# EAGLE design mp4560_ps (EAGLE 8.1.1)
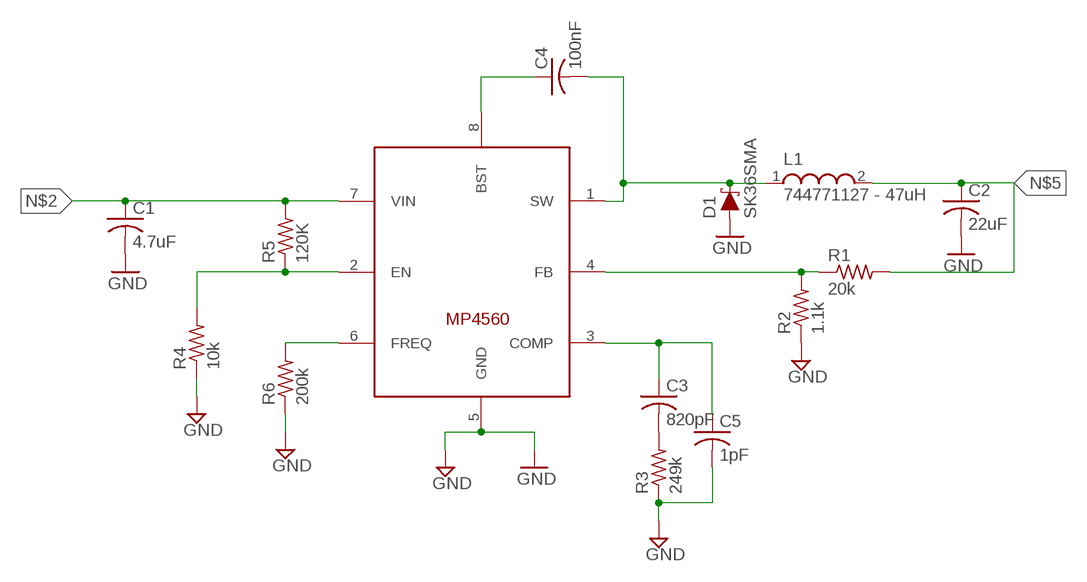
[diagram p0: schematic, sheet 1]

## Parts
C1  4.7uF  C-USC1210  [C1210]
C2  22uF  C-USC1210  [C1210]
C3  820pF  C-USC0805  [C0805]
C4  100nF  C-USC0805  [C0805]
C5  1pF  C-USC0805  [C0805]
D1  SK36SMA  DIODE-SCHOTTKY-B340A  [SMA-DIODE]
L1  744771127 - 47uH  WE-PD_1260/1245/1280/1210  [WE-PD_1260/1245/1280/1210]
R1  20k  R-US_R0805  [R0805]
R2  1.1k  R-US_R0805  [R0805]
R3  249k  R-US_R0805  [R0805]
R4  10k  R-US_R0805  [R0805]
R5  120K  R-US_R0805  [R0805]
R6  200k  R-US_R0805  [R0805]
U$1  MP4560  [SOIC8]

## Nets
GND: C1.2 C2.2 C5.2 D1.A R2.1 R3.1 R4.1 R6.1 U$1.5(GND)
N$1: R4.2 R5.1 U$1.2(EN)
N$2: C1.1 R5.2 U$1.7(VIN)
N$3: R6.2 U$1.6(FREQ)
N$4: R1.1 R2.2 U$1.4(FB)
N$5: C2.1 L1.2 R1.2
N$6: C4.1 U$1.8(BST)
N$8: C4.2 D1.C L1.1 U$1.1(SW)
N$9: C3.2 R3.2
N$10: C3.1 C5.1 U$1.3(COMP)

## Library data of the parts
C1-C5 = adafruit:C-US: CAPACITOR, American symbol
D1 = SparkFun-DiscreteSemi:DIODE-SCHOTTKY: Schottky diode A Schottky diode is a semiconductor diode which has a low forward voltage drop and a very fast switching action.; PROD_ID: DIO-09886; VALUE: 3A/40V/500mV
L1 = EAGLE-POWER_MAGNETICS-rev17a:WE-PD: SMD Shielded Power Inductor Characteristics Magnetically shielded version which results in a low leakage field High Saturation currents up to 25 A Very low self-losses at high switching frequency‘s Wide inductances spectrum available at all sizes Operating temperature: –40 °C to +125 °C Applications Perfectly suitable for switching regulators with extremely high efficiency Integrated DC/DC- converter Switching regulators with low operating voltages (Graphic cards, embedded PC-Cards, Mainboards) Plastic base: Because of the one piece construction these are more suitable for high vibration or shock applications <http://katalog.we-online.de/media/images/v2/Family_WE-PD.jpg> Details see: http://katalog.we-online.de/en/pbs/WE-PD? Updated by Dan Xu 2014-07-08 2014 (C) Wurth Elektronik
R1-R6 = adafruit:R-US_: RESISTOR, American symbol
U$1 = so8-0005:MP4560

## Net classes
0 default: clearance 0.254 mm

## Board
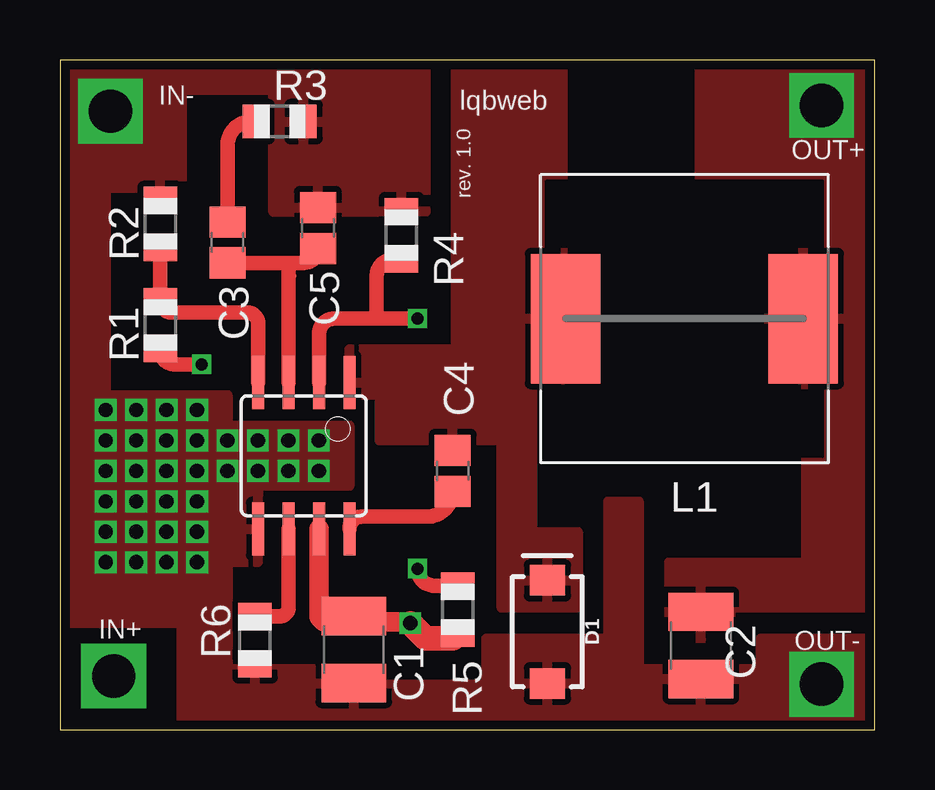
[diagram p1: board, top side]
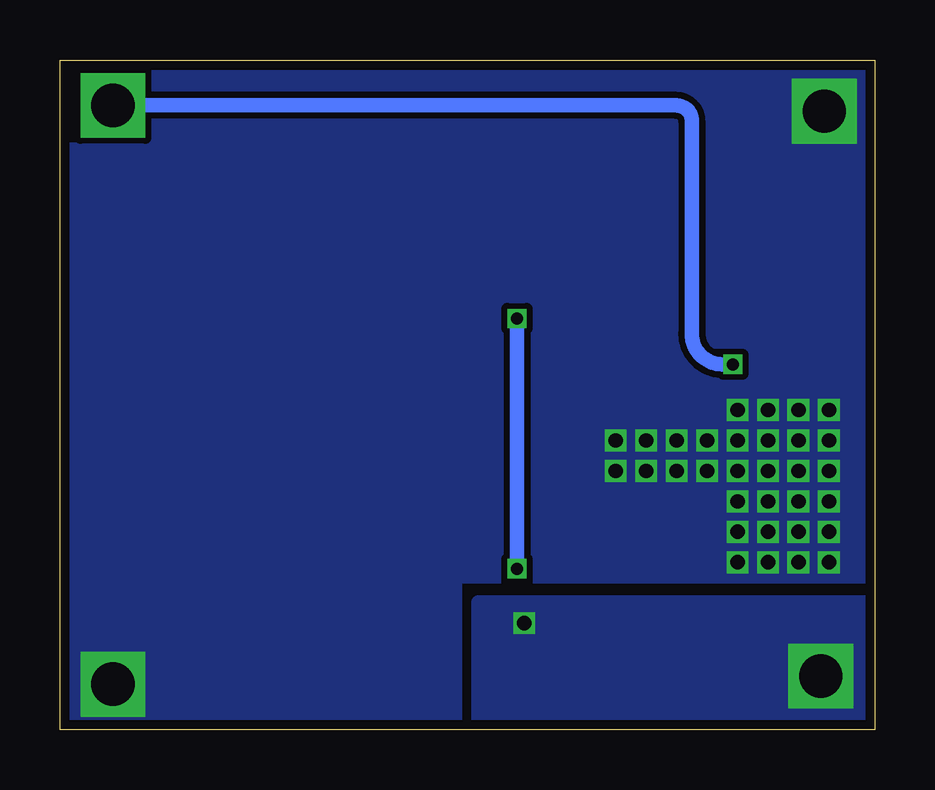
[diagram p2: board, bottom side, seen from below]

Size 33.96 x 27.93 mm. Coordinates in mm from the lower left corner, seen from the top.
Outline: 0,0 33.96,0 33.96,27.93 0,27.93 0,0
Copper layers (1*16): Top 0.035mm / dielectric 1.5mm / Bottom 0.035mm
Design rules "NOA Eagle Rule 2016-06-12": minimum track width 6mil, minimum drill 0.3mm, track to track 6mil, track to pad 6mil, pad to pad 6mil, via to via 6mil, smd to smd 0mil, copper to edge 0.4mm, drill to drill 10mil, minimum pad ring 10mil, minimum via ring 6mil, stop-mask expansion 2mil, vias tented up to drill 25mil, thermal gap 10mil

### Footprints (pad centres in the part's own frame; a part is rotated, then mirrored left to right if it is on the bottom)
C1210 = smd 1.6 x 2.7: 1 -1.4,0; 2 1.4,0
C0805 = smd 1.3 x 1.5: 1 -0.85,0; 2 0.85,0
SMA-DIODE = smd 1.27 x 1.47: A -2.15,0; C 2.15,0
WE-PD_1260/1245/1280/1210 = smd 2.9 x 5.4: 1 -4.95,0; 2 4.95,0
R0805 = smd 1.1 x 1.4: 1 -1,0; 2 1,0
SOIC8 = smd 0.5 x 2.2: 1 -1.905,-3.048; 2 -0.645,-3.048; 3 0.625,-3.048; 4 1.895,-3.048; 5 1.905,3.048; 6 0.635,3.048; 7 -0.635,3.048; 8 -1.905,3.048

### Placement (x,y rotation side)
C1  12.25,3.35 270 top
C2  26.72,3.52 270 top
C3  6.99,20.32 90 top
C4  16.37,10.79 90 top
C5  10.76,20.92 90 top
D1  20.32,4.09 90 top
L1  26.04,17.14 0 top
R1  4.18,16.88 270 top
R2  4.18,21.09 270 top
R3  9.15,25.36 180 top
R4  14.23,20.62 270 top
R5  16.58,5.01 270 top
R6  8.13,3.74 90 top
U$1  10.16,11.43 180 top

### Tracks (layer width: path | path; a pad name or v marks a point on that pad's centre or on a via)
GND  (via drill 0.6, 1.8)
  other vias: 4.45,10.79 3.17,10.79 1.91,10.79 5.71,10.79 1.91,12.06 4.45,12.06 3.17,12.06 5.71,12.06 6.99,12.06 8.26,12.06 9.53,12.06 10.79,12.06 10.79,10.79 9.53,10.79 8.26,10.79 6.99,10.79 1.91,9.53 3.17,9.53 4.45,9.53 5.71,9.53 1.91,8.26 3.17,8.26 4.45,8.26 5.71,8.26 1.91,6.99 3.17,6.99 4.45,6.99 5.71,6.99 1.91,13.34 3.17,13.34 4.45,13.34 5.71,13.34 31.75,1.91 2.1,25.8
  pour Top: 15.24,21.59 8.89,21.59 8.89,26.67 5.08,26.67 5.08,22.59 1.91,22.59 1.91,13.97 6.99,13.97 6.99,12.7 12.06,12.7 12.06,10.16 8.26,10.16 8.26,6.99 6.99,6.99 6.99,2.54 13.34,2.54 13.34,1.91 17.78,1.91 17.78,3.81 22.86,3.81 22.86,9.53 24.13,9.53 24.13,2.54 29.21,2.54 29.21,3.81 34.29,3.81 34.29,0 5.08,0 5.08,4.45 0,4.45 0,29.21 15.24,29.21
  pour Bottom: -0.6,29.1 -0.6,6.6 -0.6,6.3 17.4,6.3 17.4,-0.6 35.1,-0.6 35.1,29.1
N$1  (via drill 0.5)
  Top 0.406: R4.2 13.92,19.62
  Top 0.61: U$1.2 10.8,16.52 arc-90 11.43,17.14 13.2,17.14 | 13.2,17.14 v14.9,17.14 | 13.92,19.62 arc90 13.2,18.9 13.2,17.14 | v14.9,6.72 arc90 15.62,6.01 R5.1
  Bottom 0.61: v14.9,17.14 v14.9,6.72
N$2  (via drill 0.6, 1.8)
  Top 0.406: 14.55,4.5 arc-90 v14.61,4.45 | U$1.7 arc90 U$1.7 | 12.45,4.75 arc-90 12.7,4.5
  Top 0.61: R5.2 arc-90 16.38,3.81
  Top 0.813: 14.55,4.5 12.7,4.5 11.1,4.5 arc-90 10.8,4.8 U$1.7 | C1.1 12.45,4.75
  Top 1.016: 16.38,3.81 15.24,3.81 v14.61,4.45
  other vias: 2.24,2.24
  pour Bottom: 0,5.31 16.51,5.31 16.51,0 0,0
N$3
  Top 0.61: U$1.6 9.53,5.08 arc-90 9.19,4.74 R6.2
N$4
  Top 0.61: R2.2 R1.1 arc90 4.66,17.4 7.8,17.4 arc-90 8.27,16.93 U$1.4
N$5  (via drill 0.5, 1.8)
  Top 0.406: 31.75,25.4 v31.75,26.04 31.75,26.67
  Top 0.61: R1.2 arc90 4.75,15.24 v5.91,15.24
  Bottom 0.61: v31.75,26.04 8.26,26.04 arc90 7.62,25.4 7.62,16.51 arc-90 6.35,15.24 v5.91,15.24
  pour Top: 27.94,3.81 25.4,3.81 25.4,6.99 31.11,6.99 31.11,14.61 26.67,14.61 26.67,28.57 33.66,28.57 33.66,5.08 27.94,5.08
N$6
  Top 0.61: 16.51,10.16 16.51,10.09 arc-90 C4.1 arc-90 15.31,8.89 12.57,8.89 arc90 U$1.8
N$8
  pour Top: 12.06,13.97 12.06,15.88 16.51,15.88 16.51,27.94 20.95,27.94 20.95,14.61 19.68,14.61 19.68,8.26 21.59,8.26 21.59,5.08 18.41,5.08 18.41,12.06 13.34,12.06 13.34,13.97
N$9
  Top 0.61: R3.2 arc90 6.99,24.5 C3.2
N$10
  Top 0.406: 9.65,18.92 arc-90 9.53,19.05
  Top 0.61: 8.89,19.47 9.53,19.47 9.53,19.05 9.53,14.49 arc90 U$1.3 | 8.89,19.47 C3.1 | 8.89,19.47 10.16,19.47 arc90 C5.1

### Text on the board
tPlace: lqbweb | IN- | rev. 1.0 | OUT+ | IN+ | OUT-